# EasyEDA Pro project ProDoc_Schematic1_2025-02-16.epro

# Schematic Schematic1
Board Name: Board1; Create Date: 2025-02-06; Page Name: P1; Project Name: RemoteDoorLock; Schematic Name: Schematic1; Update Date: 2025-02-06; Company: 嘉立创EDA; Page Size: A4; Version: V1.0
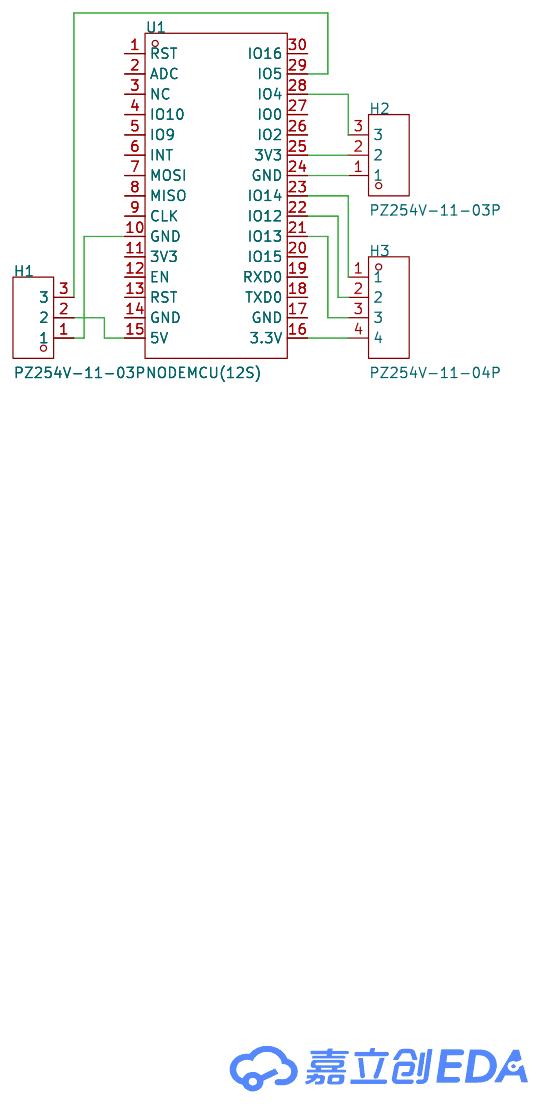
[diagram p0: schematic sheet]

## Parts
H1  PZ254V-11-03P  [HDR-TH_3P-P2.54-V-M]
H2  PZ254V-11-03P  [HDR-TH_3P-P2.54-V-M]
H3  PZ254V-11-04P  [HDR-TH_4P-P2.54-V-M]
U1  NODEMCU(12S)  [COMM-TH_L43.7-W25.4-P2.54_NODEMCU]

## Library data of the parts
H1 H2 = PZ254V-11-03P: 插针结构:1x3P;间距:2.54mm;行距:-;圆针/方针:方针;安装类型:直插;排数:单排;总PIN位数:3P;额定电流:3A;额定电压:250V;配合针长度:6mm;塑高:2.5mm;端接针长度:3mm;工作温度范围:-40℃~+105℃;颜色:黑色;; LCSC Part Name: 间距:2.54mm 1x3P 直插 方针; Supplier Part: C2937625; Manufacturer: XFCN(兴飞); Supplier Footprint: 插件,P=2.54mm; JLCPCB Part Class: 扩展库; Datasheet: https://atta.szlcsc.com/upload/public/pdf/source/20200309/C492402_8335C3D49C4E4C618838D59BB1D024C1.pdf; Supplier: LCSC; Pin Structure: 1x3P; Pitch: 2.54mm; Circluar Pins/Square Pins: 方针; Mounting Type: 直插; Number of Rows: 单排; Number of Pins: 3P; Current Rating (Max): 3A; Voltage Rating (Max): 250V; Length of Mating Pin: 6mm; Insulation Height: 2.5mm; Length of End Connection Pin: 3mm; Operating Temperature Range: -40℃~+105℃; Color: 黑色
H3 = PZ254V-11-04P: 插针结构:1x4P;间距:2.54mm;行距:-;圆针/方针:方针;安装类型:直插;排数:单排;总PIN位数:4P;额定电流:3A;额定电压:250V;配合针长度:6mm;塑高:2.5mm;端接针长度:3mm;触头材质:-;工作温度范围:-40℃~+105℃;颜色:黑色;; LCSC Part Name: 间距:2.54mm 1x4P 直插 方针; Supplier Part: C2691448; Manufacturer: XFCN(兴飞); Supplier Footprint: 插件,P=2.54mm; JLCPCB Part Class: 扩展库; Datasheet: https://atta.szlcsc.com/upload/public/pdf/source/20200309/C492403_F9F19131791D08044AD4F84F8E751A34.pdf; Supplier: LCSC; Pin Structure: 1x4P; Pitch: 2.54mm; Circluar Pins/Square Pins: 方针; Mounting Type: 直插; Number of Rows: 单排; Number of Pins: 4P; Current Rating (Max): 3A; Voltage Rating (Max): 250V; Length of Mating Pin: 6mm; Insulation Height: 2.5mm; Length of End Connection Pin: 3mm; Operating Temperature Range: -40℃~+105℃; Color: 黑色
U1 = NODEMCU(12S): 处理器:-;运行内存:-;USB:-;WIFI协议:-;蓝牙:-;以太网:-;; LCSC Part Name: wifi测试板 NODEMCU(12S); Supplier Part: C2764073; Manufacturer: Ai-Thinker(安信可); JLCPCB Part Class: Extended Part; Datasheet: https://atta.szlcsc.com/upload/public/pdf/source/20210401/C2764073_24755F314752A2828420B4B3FC3498D8.pdf; Supplier: LCSC

## Nets
Net-(H1-1): H1.1 U1.10(GND)
Net-(H1-2): H1.2 U1.15(5V)
Net-(H1-3): H1.3 U1.29(IO5)
Net-(H2-1): H2.1 U1.24(GND)
Net-(H2-2): H2.2 U1.25(3V3)
Net-(H2-3): H2.3 U1.28(IO4)
Net-(H3-1): H3.1 U1.23(IO14)
Net-(H3-2): H3.2 U1.22(IO12)
Net-(H3-3): H3.3 U1.21(IO13)
Net-(H3-4): H3.4 U1.16(3.3V)

Not connected (* = marked no-connect by the designer): U1 1(RST) 2(ADC) 3(NC) 4(IO10) 5(IO9) 6(INT) 7(MOSI) 8(MISO) 9(CLK) 11(3V3) 12(EN) 13(RST) 14(GND) 17(GND) 18(TXD0) 19(RXD0) 20(IO15) 26(IO2) 27(IO0) 30(IO16)
